# Altium project MelansonTech Isolated Current Sense Rev 2.PrjPcb
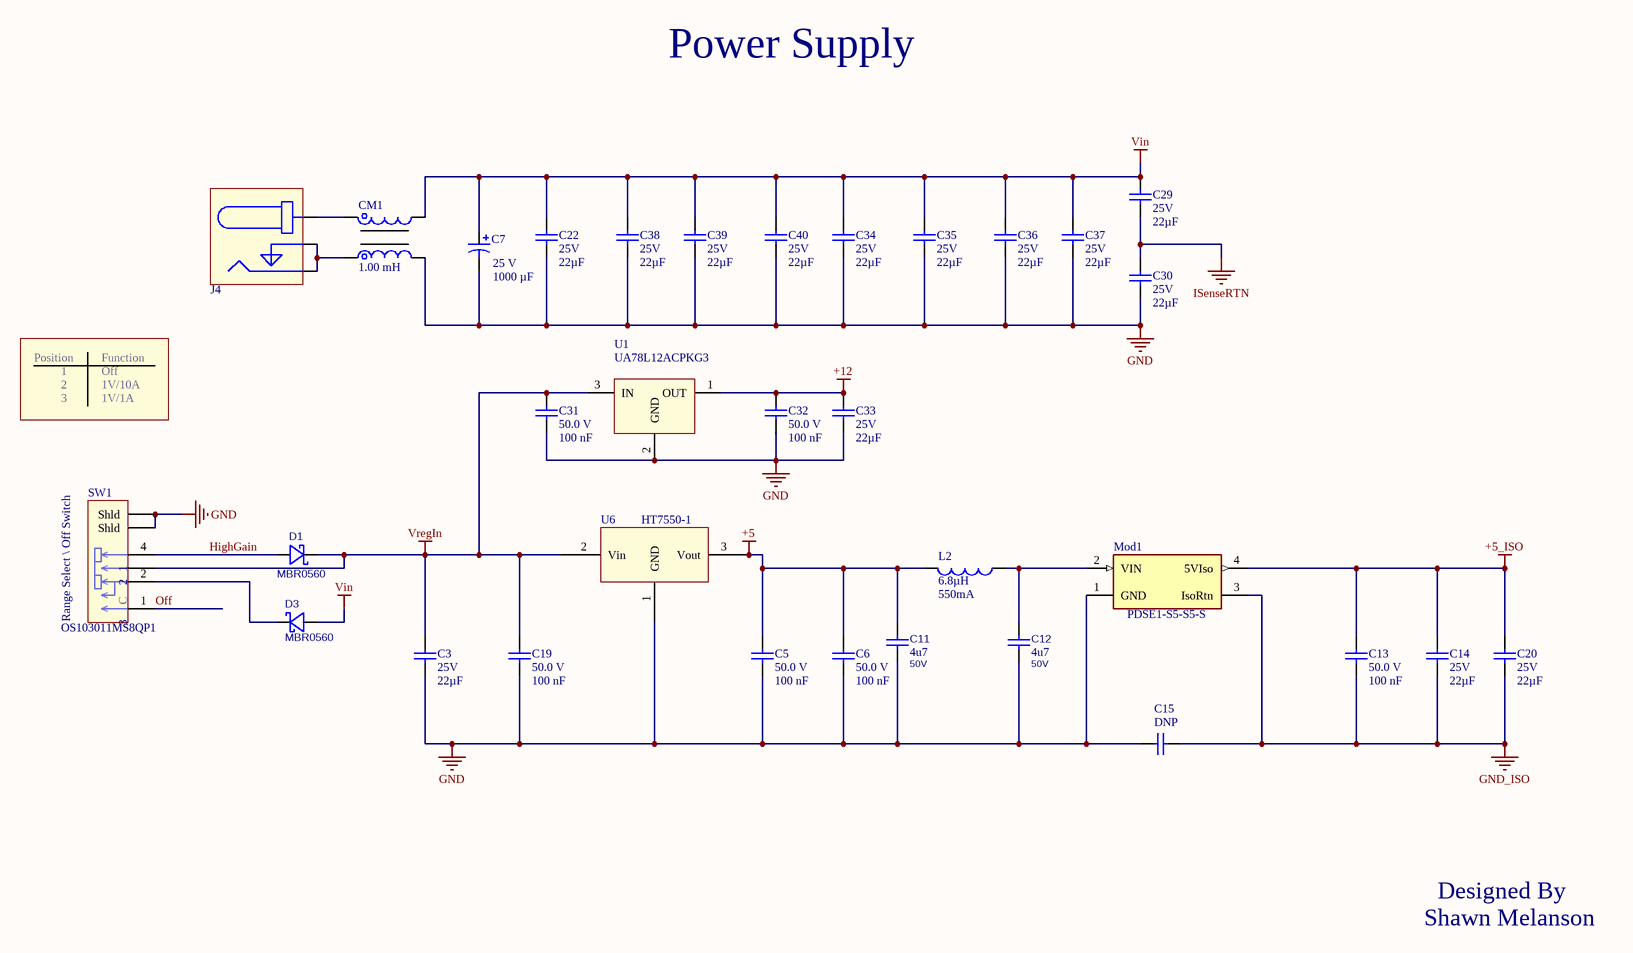
[diagram p0: MelansonTech PSU_IsolatedShuntAmp Rev2.SchDoc]
2 sheets, 102 parts. Net scope: global (net labels, ports and power ports of the same name join across sheets).
Sheets:
  MelansonTech PSU_IsolatedShuntAmp Rev2.SchDoc
  MelansonTech Isolated Shunt Amplifier rev 2.SchDoc

## Sheet MelansonTech PSU_IsolatedShuntAmp Rev2.SchDoc
size B

### Parts
C3  Voltage - Rated: 25V  Capacitance: 22µF  [Cap,0805]  (hidden comment: CL21A226MAQNNNE)
C5  Voltage Rating (DC): 50.0 V  Capacitance: 100 nF  [CAP, 0805, HD]  (hidden comment: CC0805KRX7R9BB104)
C6  Voltage Rating (DC): 50.0 V  Capacitance: 100 nF  [CAP, 0805, HD]  (hidden comment: CC0805KRX7R9BB104)
C7  Capacitance: 1000 µF  Voltage - Rated: 25 V  [Cap,5mm Lead Spaceing,14mm HIGH,10MM Dia, Polymer - RA1]  (hidden comment: A750MV108M1EAAE014)
C11  Capacitance: 4u7  Voltage: 50V  [Cap, 1206]  (hidden comment: CL31B475KBHNNNE)
C12  Capacitance: 4u7  Voltage: 50V  [Cap, 1206]  (hidden comment: CL31B475KBHNNNE)
C13  Voltage Rating (DC): 50.0 V  Capacitance: 100 nF  [Cap,0805]  (hidden comment: CC0805KRX7R9BB104)
C14  Voltage - Rated: 25V  Capacitance: 22µF  [Cap,0805]  (hidden comment: CL21A226MAQNNNE)
C15  S102K33Y5PP63K5R  [Cap, 5mm Lead Spaceing, 4mm dai]  (value not drawn)
C19  Voltage Rating (DC): 50.0 V  Capacitance: 100 nF  [CAP, 0805, HD]  (hidden comment: CC0805KRX7R9BB104)
C20  Voltage - Rated: 25V  Capacitance: 22µF  [Cap,0805]  (hidden comment: CL21A226MAQNNNE)
C22  Voltage - Rated: 25V  Capacitance: 22µF  [Cap,0805]  (hidden comment: CL21A226MAQNNNE)
C29  Voltage - Rated: 25V  Capacitance: 22µF  [Cap,0805]  (hidden comment: CL21A226MAQNNNE)
C30  Voltage - Rated: 25V  Capacitance: 22µF  [Cap,0805]  (hidden comment: CL21A226MAQNNNE)
C31  Voltage Rating (DC): 50.0 V  Capacitance: 100 nF  [CAP, 0805, HD]  (hidden comment: CC0805KRX7R9BB104)
C32  Voltage Rating (DC): 50.0 V  Capacitance: 100 nF  [CAP, 0805, HD]  (hidden comment: CC0805KRX7R9BB104)
C33  Voltage - Rated: 25V  Capacitance: 22µF  [Cap,0805]  (hidden comment: CL21A226MAQNNNE)
C34  Voltage - Rated: 25V  Capacitance: 22µF  [Cap,0805]  (hidden comment: CL21A226MAQNNNE)
C35  Voltage - Rated: 25V  Capacitance: 22µF  [Cap,0805]  (hidden comment: CL21A226MAQNNNE)
C36  Voltage - Rated: 25V  Capacitance: 22µF  [Cap,0805]  (hidden comment: CL21A226MAQNNNE)
C37  Voltage - Rated: 25V  Capacitance: 22µF  [Cap,0805]  (hidden comment: CL21A226MAQNNNE)
C38  Voltage - Rated: 25V  Capacitance: 22µF  [Cap,0805]  (hidden comment: CL21A226MAQNNNE)
C39  Voltage - Rated: 25V  Capacitance: 22µF  [Cap,0805]  (hidden comment: CL21A226MAQNNNE)
C40  Voltage - Rated: 25V  Capacitance: 22µF  [Cap,0805]  (hidden comment: CL21A226MAQNNNE)
CM1  Inductance: 1.00 mH  [CM Choke,SMD, DR331]  (hidden comment: DR331-105BE)
D1  MBR0560  [SOD123]
D3  MBR0560  [SOD123]
J4  PJ-002A  [Connector,Barrel,2.1mm,5.5mm,DC power Jack]  (value not drawn)
L2  Inductance: 6.8µH  Current Rating (Amps): 550mA  [Ind, 0805]  (hidden comment: MLZ2012N6R8LT000)
Mod1  PDSE1-S5-S5-S  [CONV_PDSE1-S5-S5-S]
SW1  OS103011MS8QP1  [Switch,Slide,.SP3T, OS103011 -Side]
U1  UA78L12ACPKG3  [SOT89-3]
U6  HT7550-1  [SOT89-3]

### Nets
+5: C5.2 C6.2 C11.2 L2.2 U6.3(Vout)
+5_ISO: C13.2 C14.2 C20.2 Mod1.4(5VIso)
+12: C32.2 C33.2 U1.1(OUT)
GND: C3.1 C5.1 C6.1 C7.2 C11.1 C12.1 C15.2 C19.1 C22.1 C30.1 C31.1 C32.1 C33.1 C34.1 C35.1 C36.1 C37.1 C38.1 C39.1 C40.1 CM1.4 Mod1.1(GND) SW1.5(Shld) SW1.6(Shld) U1.2(GND) U6.1(GND)
GND_ISO: C13.1 C14.1 C15.1 C20.1 Mod1.3(IsoRtn)
ISenseRTN: C29.1 C30.2
Vin: C7.1 C22.2 C29.2 C34.2 C35.2 C36.2 C37.2 C38.2 C39.2 C40.2 CM1.2 D3.2(A)
VregIn: C3.2 C19.2 C31.2 D1.1(C) SW1.3 U1.3(IN) U6.2(Vin)
HighGain: D1.2(A) SW1.4
Off: SW1.1
NetC12_2: C12.2 L2.1 Mod1.2(VIN)
NetCM1_1: CM1.1 J4.1
NetCM1_3: CM1.3 J4.2 J4.3
NetD3_1: D3.1(C) SW1.2

### Notes on the sheet
- Power Supply
- Position
- 1
- 2
- Function
- Off
- 1V/10A
- 3
- 1V/1A
- Range Select \ Off Switch
- (near C15) DNP
- Shawn Melanson
- Designed By
- (in symbol Switch,TH,Slide,SP3T,100MA,12V,OS103011MS8QP1) C

### Library data of the parts
C3 C14 C20 C22 C29 C30 C33-C40 = Cap,0805,22uF,25V,X5R,±20%,CL21A226MAQNNNE: CAP CER 22UF 25V X5R 0805; Manufacturer: Samsung Electro-Mechanics; Detailed Description: 22 µF ±20% 6.3V Ceramic Capacitor X5R 0805 (2012 Metric); Tolerance: ±20%; mfg P/N: CL21A226MAQNNNE; Category: Capacitors  Ceramic Capacitors; Series: CL; Part Status: Active; Temperature Coefficient: X5R; Operating Temperature: -55°C ~ 85°C; Applications: General Purpose; Mounting Type: Surface Mount, MLCC; Package / Case: 0805 (2012 Metric); Size / Dimension: 0.079" L x 0.049" W (2.00mm x 1.25mm); Thickness (Max): 0.055" (1.40mm); Supplier 1: Mouser; Supplier Part Number 1: 187-CL31B226KPHNNNE; Supplier 2: Digikey; Supplier Part Number 2: 1276-2769-6-ND; Supplier 3: Digikey; Supplier Part Number 3: 1276-2769-1-ND
C5 C6 C13 C19 C31 C32 = Cap,0805,100nf,50V,5%,CC0805KRX7R9BB104: CAP CER 0.1UF 50V X7R 0805; Manufacturer: YAGEO; Capacitance Tolerance: ±10%; Detailed Description: 0.1 µF ±10% 50V Ceramic Capacitor X7R 0805 (2012 Metric); Supplier 1: Digikey; Supplier Part Number 1: 311-1140-6-ND; Supplier 2: Digikey; Supplier Part Number 2: 311-1140-1-ND; Supplier 3: Mouser; Supplier Part Number 3: 603-CC805KRX7R9BB104; Supplier 4: Arrow Electronics; Supplier Part Number 4: CC0805KRX7R9BB104; Supplier 5: Digikey; Supplier Part Number 5: 311-1140-2-ND; Supplier 6: Future Electronics; Supplier Part Number 6: 2986263; Manufacturer Product Number: CC0805KRX7R9BB104; Category: Capacitors  Ceramic Capacitors; Series: CC; Part Status: Active; Temperature Coefficient: X7R; Operating Temperature: -55°C ~ 125°C; Applications: General Purpose; Mounting Type: Surface Mount, MLCC; Package / Case: 0805 (2012 Metric); Size / Dimension: 0.079" L x 0.049" W (2.00mm x 1.25mm); Thickness (Max): 0.033" (0.85mm)
C7 = Cap,Polar,TH,1000uF,25V,Polymer,±20%,A750MV108M1EAAE014: 1000 µF 25 V Aluminum - Polymer Capacitors Radial, Can 14mOhm 2000 Hrs @ 105°C; Manufacturer: KEMET; Tolerance: ±20%; Ripple Current @ Low Frequency: 255 mA @ 120 Hz; Ripple Current @ High Frequency: 5.1 A @ 100 kHz; Base Product Number: A750MV; mfg P/N: A750MV108M1EAAE014; Detailed Description: 1000 µF 25 V Aluminum - Polymer Capacitors Radial, Can 14mOhm 2000 Hrs @ 105°C; Category: Capacitors  Aluminum - Polymer Capacitors; Series: A750; Part Status: Active; Type: Polymer; ESR (Equivalent Series Resistance): 14mOhm; Lifetime @ Temp.: 2000 Hrs @ 105°C; Operating Temperature: -55°C ~ 105°C; Applications: General Purpose; Lead Spacing: 0.197" (5.00mm); Size / Dimension: 0.394" Dia (10.00mm); Height - Seated (Max): 0.630" (16.00mm); Mounting Type: Through Hole; Package / Case: Radial, Can; Supplier 1: Digi-Key; Supplier Part Number 1: 399-A750MV108M1EAAE014-ND; Supplier 2: Mouser; Supplier Part Number 2: 80-A750MV108M1EAAE14
C11 C12 = Cap,1206,4.7uF,10%,50V,CL31B475KBHNNNE: Cap,SMD,MLCC,4u7,50V,X7R,10%,1206; Manufacturer: Samsung; Manufacturer P/N: CL31B475KBHNNNE; Tolerance: 10%; Package: 1206; Supplier 1: LCSC; Supplier Part Number 1: C51205; Supplier 2: Digi-Key; Supplier Part Number 2: 1276-2789-1-ND
C15 = Cap,TH,Ceramic,5mm Spacing,1nF,2kV, S102K33Y5PP63K5R: CAP CER 1000PF 2KV Y5P RADIAL; Manufacturer: Vishay BC Components; Detailed Description: 1000pF ±10% 2000V (2kV) Ceramic Capacitor Y5P (B) Radial, Disc; Tolerance: ±10%; Temperature Coefficient: Y5P (B); Voltage - Rated: 2000V (2kV); Capacitance: 1nF; mfg P/N: S102K33Y5PP63K5R; Category: Capacitors  Ceramic Capacitors; Series: S; Part Status: Active; Operating Temperature: -30°C ~ 125°C; Applications: General Purpose; Mounting Type: Through Hole; Package / Case: Radial, Disc; Size / Dimension: 0.335"" Dia (8.50mm); Height - Seated (Max): 0.492"" (12.50mm); Lead Spacing: 0.197"" (5.00mm); Lead Style: Formed Leads - Kinked
CM1 = common mode, 1mH@100kHz, 500mA, SMD,2ln, DR331-105BE: CMC 1MH 500MA 2LN SMD; Lead-Free Status: Lead Free; Detailed Description: 1 mH @ 100 kHz 2 Line Common Mode Choke Surface Mount 500mA DCR 400mOhm; Category  Filters: Common Mode Chokes; Filter Type: Signal Line; Number of Lines: 2; DC Resistance (DCR) (Max): 400mOhm; Voltage Rating - DC: 80V; Voltage Rating - AC: 42V; Base Product Number: DR331; mfg P/N: DR331-105BE; Mounting Style: SMD; Current Rating: 500mA; Series: DR331; Part Status: Active; Inductance @ Frequency: 1 mH @ 100 kHz; Operating Temperature: -40°C ~ 135°C; Mounting Type: Surface Mount; Size / Dimension: 0.287" L x 0.213" W (7.30mm x 5.40mm); Height (Max): 0.197" (5.00mm); Package / Case: Horizontal, 4 Flat Lead
D1 D3 = Diode,SOD123,Shottky,60V,0.5A,MBR0560: Dio,Sig,Schtky,0.5A,60V,SOD123; Manufacturer: MCC; mfg P/N: MBR0560-TP; Details: 700mV @ 500mA, 200µA @ 60V,30pF @ 4V, 1MHz; Not Stuffed: N/S; Fast Supplier: Digi-Key; Current: 0.5A; Package: SOD123; Voltage: 60V; Supplier 1: Digi-Key; Supplier Part Number 1: MBR0560TPMSCT-ND; Supplier 2: LCSC; Supplier Part Number 2: C150515
J4 = Connector,Barrel,ID 2.1mm,OD 5.5mm,Power Connect, PJ-002A: Power Barrel Connector Jack 2.10mm ID (0.083"), 5.50mm OD (0.217") Through Hole, Right Angle; Manufacturer: CUI Inc.; Actual Diameter: 0.079" (2.00mm ID), 0.256" (6.50mm OD); Number of Positions/Contacts: 2 Conductors, 3 Contacts; Mating Length/Depth: 0.354" (9.00mm); Dielectric Material: Polybutylene Terephthalate (PBT); Internal Switch(s): Does Not Contain Switch; Shielding: Unshielded; Voltage - Rated: 24VDC; Current Rating (Amps): 2.5A; Material Flammability Rating: UL94 V-0; Body Color: Black; mfg P\N: PJ-002A; Industry Recognized Mating Diameter: 2.10mm ID (0.083"), 5.50mm OD (0.217"); Connector Type: Jack; Mounting Type: Through Hole, Right Angle; Termination: Solder Eyelet(s); Contact Material - Plating: Tin; Operating Temperature: -25°C ~ 85°C; Contact Material: Brass, Copper Alloy; Supplier 1: Digi-Key; Supplier Part Number 1: CP-002A-ND
L2 = Ind,0805,6.8uH,550mA,0.25Ω, MLZ2012N6R8LT000: FIXED IND 6.8UH 550MA 250 MOHM; Manufacturer: TDK Corporation; Detailed Description: 6.8µH Shielded Multilayer Inductor 550mA 250mOhm 0805 (2012 Metric); Type: Multilayer; Material - Core: Ferrite; Tolerance: ±20%; Current - Saturation: 110mA; Shielding: Shielded; Frequency - Self Resonant: 60MHz; Inductance Frequency - Test: 2MHz; mfg P/N: MLZ2012N6R8LT000; Category: Inductors, Coils, Chokes  Fixed Inductors; Series: MLZ; Part Status: Active; DC Resistance (DCR): 250mOhm; Operating Temperature: -55°C ~ 125°C; Mounting Type: Surface Mount; Package / Case: 0805 (2012 Metric); Supplier Device Package: 0805 (2012 Metric); Size / Dimension: 0.079"" L x 0.049"" W (2.00mm x 1.25mm); Height - Seated (Max): 0.041"" (1.05mm); Supplier 1: Digi-Key; Supplier Part Number 1: 445-6761-1-ND; Supplier 2: LCSC; Supplier Part Number 2: C82157
Mod1 = Mod,PSU,4.5-5.5Vin,5Vout,1W, PDSE1-S5-S5-S: DC-DC ISOLATED, 1 W, 4.5-5.5 VDC; Manufacturer: CUI Inc.; Detailed Description: Isolated Module DC DC Converter 1 Output 5V    200mA 4.5V - 5.5V Input; Voltage - Isolation: 3kV; Voltage - Input (Min): 4.5V; Voltage - Input (Max): 5.5V; Voltage - Output 1: 5V; Current - Output (Max): 200mA; Efficiency: 82%; Approval Agency: CE, cURus; Number of Outputs: 1; Power (Watts): 1W; mfg P/N: PDSE1-S5-S5-S; Series: PDSE1-S (1W); Category: Power Supplies - Board Mount  DC DC Converters; Part Status: Active; Type: Isolated Module; Applications: ITE (Commercial); Features: SCP; Operating Temperature: -40°C ~ 105°C (With Derating); Mounting Type: Through Hole; Package / Case: 4-SIP Module; Size / Dimension: 0.46"" L x 0.24"" W x 0.40"" H (11.6mm x 6.0mm x 10.2mm); Supplier 1: Digi-Key; Supplier Part Number 1: 102-6291-ND
SW1 = Switch,TH,Slide,SP3T,100MA,12V,OS103011MS8QP1: SWITCH SLIDE SP3T 100MA 12V; Manufacturer: C&K; Detailed Description: Slide Switch SP3T Through Hole; Switch Function: On-On-On; Current Rating (Amps): 100mA (DC); Actuator Type: Standard; Actuator Length: 4.00mm; Actuator Material: Polyoxymethylene (Acetal) (POM); Switch Travel: 2.00mm; Mechanical Life: 10,000 Cycles; mfg P/N: OS103011MS8QP1; Part Status: Active; Circuit: SP3T; Voltage Rating - DC: 12V; Contact Material: Copper Alloy; Contact Finish: Silver; Mounting Type: Through Hole; Termination Style: PC Pin; Features: Epoxy Sealed Terminals; Operating Temperature: -30°C ~ 70°C; Electrical Life: 10,000 Cycles; Supplier 1: Digi-Key; Supplier Part Number 1: CKN9543-ND; Supplier 2: LCSC; Supplier Part Number 2: C221831
U1 = Reg,Linear,Pos,Fixed,12Vout,27Vin,100mA,UA78L12ACPKG3: IC REG LINEAR 12V 100MA SOT89-3; Manufacturer: Texas Instruments; Detailed Description: Linear Voltage Regulator IC Positive Fixed 1 Output 100mA SOT-89-3; Output Configuration: Positive; Output Type: Fixed; Voltage - Input (Max): 27V; Voltage Dropout (Max): 1.7V @ 40mA; PSRR: 42dB (120Hz); Protection Features: Over Current, Over Temperature, Reverse Polarity, Short Circuit; Number of Regulators: 1; mfg P/N: UA78L12ACPKG3; Category: Integrated Circuits (ICs)  PMIC - Voltage Regulators - Linear; Part Status: Active; Voltage - Output (Min/Fixed): 12V; Current - Output: 100mA; Operating Temperature: 0°C ~ 125°C; Mounting Type: Surface Mount; Package / Case: TO-243AA; Supplier Device Package: SOT-89-3; Base Product Number: UA78L12; Supplier 1: Digi-Key; Supplier Part Number 1: 296-50454-6-ND; Supplier 2: Mouser; Supplier Part Number 2: 595-UA78L12ACPKG3; Supplier 3: Arrow Electronics; Supplier Part Number 3: UA78L12ACPKG3
U6 = Reg,Linear,Fixed,SOT-89-3,30Vin,5Vout,150mA,HT7550-1: LOW DROPOUT REGULATORS(LDO) POSITIVE FIXED 55MV @ 1MA 30V 5V 150MA SOT-89(SOT-89-3) ROHS; Manufacturer: Holtek Semicon; Input Voltage (Max): 30Vdc; Output voltage accuracy: tolerance ±3%; Quiescent current: 2.5μA; Output Voltage: 5Vdc; LCSC Part #: C16106; Package: SOT-89-3; Output Current (Max): 150mA; mfg P/N: HT7550-1

## Sheet MelansonTech Isolated Shunt Amplifier rev 2.SchDoc
size C
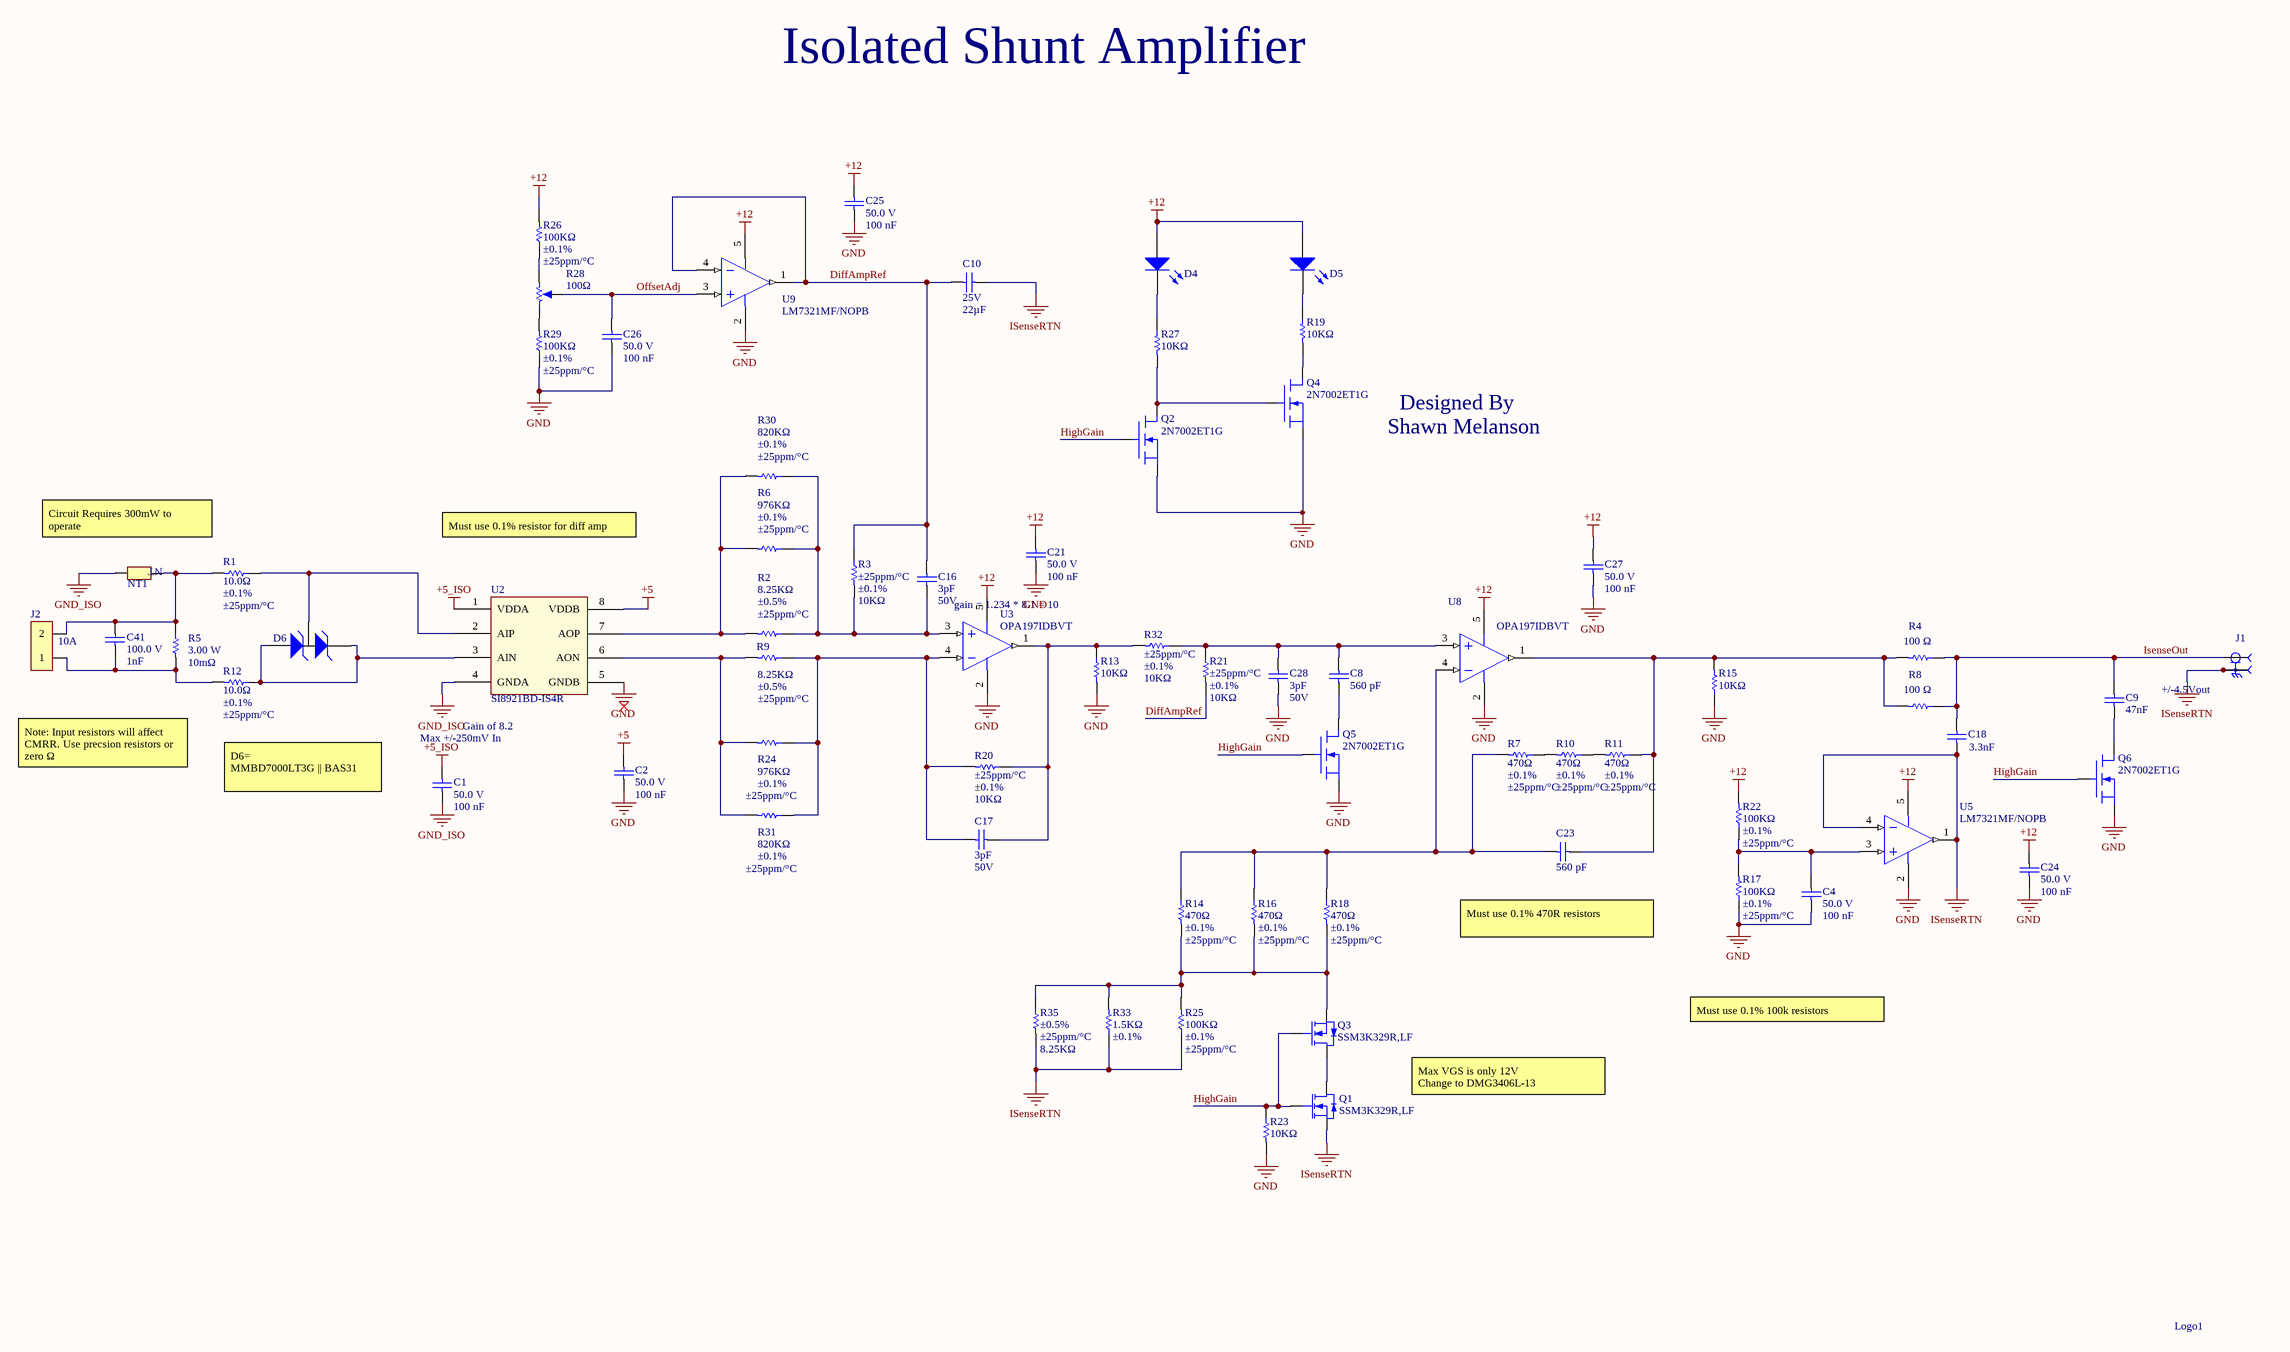
[diagram p1: MelansonTech Isolated Shunt Amplifier rev 2.SchDoc]

### Parts
C1  Voltage Rating (DC): 50.0 V  Capacitance: 100 nF  [CAP, 0805, HD]  (hidden comment: CC0805KRX7R9BB104)
C2  Voltage Rating (DC): 50.0 V  Capacitance: 100 nF  [CAP, 0805, HD]  (hidden comment: CC0805KRX7R9BB104)
C4  Voltage Rating (DC): 50.0 V  Capacitance: 100 nF  [CAP, 0805, HD]  (hidden comment: CC0805KRX7R9BB104)
C8  Capacitance: 560 pF  [CAP, 0805, HD]  (hidden comment: CC0805JRNPO9BN561)
C9  Capacitance: 47nF  [CAP, 0805, HD]  (hidden comment: CL21B473KCFNNNE)
C10  Voltage - Rated: 25V  Capacitance: 22µF  [Cap,0805]  (hidden comment: CL21A226MAQNNNE)
C16  Capacitance: 3pF  Voltage - Rated: 50V  [CAP, 0805, HD]  (hidden comment: CC0805CRNPO9BN3R0)
C17  Capacitance: 3pF  Voltage - Rated: 50V  [CAP, 0805, HD]  (hidden comment: CC0805CRNPO9BN3R0)
C18  Capacitance: 3.3nF  [CAP, 0805, HD]  (hidden comment: CC0805KPX7R9BB332)
C21  Voltage Rating (DC): 50.0 V  Capacitance: 100 nF  [CAP, 0805, HD]  (hidden comment: CC0805KRX7R9BB104)
C23  Capacitance: 560 pF  [Cap,0805]  (hidden comment: CC0805JRNPO9BN561)
C24  Voltage Rating (DC): 50.0 V  Capacitance: 100 nF  [CAP, 0805, HD]  (hidden comment: CC0805KRX7R9BB104)
C25  Voltage Rating (DC): 50.0 V  Capacitance: 100 nF  [CAP, 0805, HD]  (hidden comment: CC0805KRX7R9BB104)
C26  Voltage Rating (DC): 50.0 V  Capacitance: 100 nF  [CAP, 0805, HD]  (hidden comment: CC0805KRX7R9BB104)
C27  Voltage Rating (DC): 50.0 V  Capacitance: 100 nF  [CAP, 0805, HD]  (hidden comment: CC0805KRX7R9BB104)
C28  Capacitance: 3pF  Voltage - Rated: 50V  [CAP, 0805, HD]  (hidden comment: CC0805CRNPO9BN3R0)
C41  Voltage Rating (DC): 100.0 V  Capacitance: 1nF  [CAP, 0805, HD]  (hidden comment: C0805X102J1GACAUTO)
D4  OVLBB4C7  [LED,TH,T1,3MM-Vert]  (value not drawn)
D5  OVLBB4C7  [LED,TH,T1,3MM-Vert]  (value not drawn)
D6  BAT54SLT1G  [SOT23-3]  (value not drawn)
J1  142-0701-801  [CINCH_142-0701-801]  (value not drawn)
J2  TE Connectivity 282836-2  [TERM BLOCK 2POS SIDE ENTRY 5MM]  (value not drawn)
Logo1  Open Source Logo  [Symbol,Open Source - No Text]  (value not drawn)
NT1  Net Tie,0.254mm  [0.254mm Net Tie]  (value not drawn)  (net tie, no BOM)
Q1  SSM3K329R,LF  [SOT23-3]
Q2  2N7002ET1G  [SOT23-3]
Q3  SSM3K329R,LF  [SOT23-3]
Q4  2N7002ET1G  [SOT23-3]
Q5  2N7002ET1G  [SOT23-3]
Q6  2N7002ET1G  [SOT23-3]
R1  Resistance: 10.0Ω  Tolerance: ±0.1%  Temperature Coefficient: ±25ppm/°C  [res, 0805, HD]  (hidden comment: RNCS0805BKE10R0)
R2  Tolerance: ±0.5%  Temperature Coefficient: ±25ppm/°C  Resistance: 8.25KΩ  [res, 0805, HD]  (hidden comment: RR1220P-8251-D-M)
R3  Temperature Coefficient: ±25ppm/°C  Resistance Tolerance: ±0.1%  Resistance: 10KΩ  [res, 0805, HD]  (hidden comment: RG2012P-103-B-T5)
R4  Resistance: 100 Ω  [res, 0805, HD]  (hidden comment: CRCW0805100RJNEAC)
R5  Power Rating: 3.00 W  Resistance: 10mΩ  [Res 2512]  (hidden comment: CRA2512-FZ-R010ELF)
R6  Resistance: 976KΩ  Tolerance: ±0.1%  Temperature Coefficient: ±25ppm/°C  [res, 0805, HD]  (hidden comment: ERA-6AEB9763V)
R7  Resistance: 470Ω  Tolerance: ±0.1%  Temperature Coefficient: ±25ppm/°C  [res, 0805, HD]  (hidden comment: ERA-6AEB471V)
R8  Resistance: 100 Ω  [res, 0805, HD]  (hidden comment: CRCW0805100RJNEAC)
R9  Tolerance: ±0.5%  Temperature Coefficient: ±25ppm/°C  Resistance: 8.25KΩ  [res, 0805, HD]  (hidden comment: RR1220P-8251-D-M)
R10  Resistance: 470Ω  Tolerance: ±0.1%  Temperature Coefficient: ±25ppm/°C  [res, 0805, HD]  (hidden comment: ERA-6AEB471V)
R11  Resistance: 470Ω  Tolerance: ±0.1%  Temperature Coefficient: ±25ppm/°C  [res, 0805, HD]  (hidden comment: ERA-6AEB471V)
R12  Resistance: 10.0Ω  Tolerance: ±0.1%  Temperature Coefficient: ±25ppm/°C  [res, 0805, HD]  (hidden comment: RNCS0805BKE10R0)
R13  Resistance: 10KΩ  [res, 0805, HD]  (hidden comment: Vishay / Dale CRCW080510K0FKTA)
R14  Resistance: 470Ω  Tolerance: ±0.1%  Temperature Coefficient: ±25ppm/°C  [res, 0805, HD]  (hidden comment: ERA-6AEB471V)
R15  Resistance: 10KΩ  [res, 0805, HD]  (hidden comment: Vishay / Dale CRCW080510K0FKTA)
R16  Resistance: 470Ω  Tolerance: ±0.1%  Temperature Coefficient: ±25ppm/°C  [res, 0805, HD]  (hidden comment: ERA-6AEB471V)
R17  Resistance: 100KΩ  Tolerance: ±0.1%  Temperature Coefficient: ±25ppm/°C  [res, 0805, HD]  (hidden comment: ERA-6AEB104V)
R18  Resistance: 470Ω  Tolerance: ±0.1%  Temperature Coefficient: ±25ppm/°C  [res, 0805, HD]  (hidden comment: ERA-6AEB471V)
R19  Resistance: 10KΩ  [res, 0805, HD]  (hidden comment: Vishay / Dale CRCW080510K0FKTA)
R20  Temperature Coefficient: ±25ppm/°C  Resistance Tolerance: ±0.1%  Resistance: 10KΩ  [res, 0805, HD]  (hidden comment: RG2012P-103-B-T5)
R21  Temperature Coefficient: ±25ppm/°C  Resistance Tolerance: ±0.1%  Resistance: 10KΩ  [res, 0805, HD]  (hidden comment: RG2012P-103-B-T5)
R22  Resistance: 100KΩ  Tolerance: ±0.1%  Temperature Coefficient: ±25ppm/°C  [res, 0805, HD]  (hidden comment: ERA-6AEB104V)
R23  Resistance: 10KΩ  [res, 0805, HD]  (hidden comment: Vishay / Dale CRCW080510K0FKTA)
R24  Resistance: 976KΩ  Tolerance: ±0.1%  Temperature Coefficient: ±25ppm/°C  [res, 0805, HD]  (hidden comment: ERA-6AEB9763V)
R25  Resistance: 100KΩ  Tolerance: ±0.1%  Temperature Coefficient: ±25ppm/°C  [res, 0805, HD]  (hidden comment: ERA-6AEB104V)
R26  Resistance: 100KΩ  Tolerance: ±0.1%  Temperature Coefficient: ±25ppm/°C  [res, 0805, HD]  (hidden comment: ERA-6AEB104V)
R27  Resistance: 10KΩ  [res, 0805, HD]  (hidden comment: Vishay / Dale CRCW080510K0FKTA)
R28  Resistance: 100Ω  [Res,SMD,POT,TC33 Series]  (hidden comment: TC33X-2-101E)
R29  Resistance: 100KΩ  Tolerance: ±0.1%  Temperature Coefficient: ±25ppm/°C  [res, 0805, HD]  (hidden comment: ERA-6AEB104V)
R30  Resistance: 820KΩ  Tolerance: ±0.1%  Temperature Coefficient: ±25ppm/°C  [res, 0805, HD]  (hidden comment: RG2012P-824-D-T5)
R31  Resistance: 820KΩ  Tolerance: ±0.1%  Temperature Coefficient: ±25ppm/°C  [res, 0805, HD]  (hidden comment: RG2012P-824-D-T5)
R32  Temperature Coefficient: ±25ppm/°C  Resistance Tolerance: ±0.1%  Resistance: 10KΩ  [res, 0805, HD]  (hidden comment: RG2012P-103-B-T5)
R33  Resistance: 1.5KΩ  Tolerance: ±0.1%  [res, 0805, HD]  (hidden comment: RG2012P-152-B-T5)
R35  Tolerance: ±0.5%  Temperature Coefficient: ±25ppm/°C  Resistance: 8.25KΩ  [res, 0805, HD]  (hidden comment: RR1220P-8251-D-M)
U2  SI8921BD-IS4R  [SOIC-8 DWV]
U3  OPA197IDBVT  [SOT23-5]
U5  LM7321MF/NOPB  [SOT23-5]
U8  OPA197IDBVT  [SOT23-5]
U9  LM7321MF/NOPB  [SOT23-5]

### Nets
+5: C2.2 U2.8(VDDB)
+5_ISO: C1.2 U2.1(VDDA)
+12: C21.2 C24.2 C25.2 C27.2 D4.1(A) D5.1(A) R22.2 R26.2 U3.5(V+) U5.5(V+) U8.5(V+) U9.5(V+)
GND: C2.1 C4.1 C21.1 C24.1 C25.1 C26.1 C27.1 C28.1 Q2.2(S) Q4.2(S) Q5.2(S) Q6.2(S) R13.2 R15.1 R17.1 R23.2 R29.1 U2.5(GNDB) U3.2(V-) U5.2(V-) U8.2(V-) U9.2(V-)
GND_ISO: C1.1 NT1.2 U2.4(GNDA)
ISenseRTN: C10.1 C18.1 J1.S1 J1.S2 J1.S3 J1.S4 Q1.2(S) R25.1 R33.1 R35.2 U5.1(OUT) U5.4(IN-)
DiffAmpRef: C10.2 C16.1 R3.1 R21.2 U9.1(OUT) U9.4(IN-)
HighGain: Q1.1(G) Q2.1(G) Q3.1(G) Q5.1(G) Q6.1(G) R23.1
IsenseOut: C9.2 C18.2 J1.1 R4.1 R8.1
OffsetAdj: C26.2 R28.2 U9.3(IN+)
NetC4_2: C4.2 R17.2 R22.1 U5.3(IN+)
NetC8_1: C8.1 Q5.3(D)
NetC8_2: C8.2 C28.2 R21.1 R32.1 U8.3(1IN+)
NetC9_1: C9.1 Q6.3(D)
NetC16_2: C16.2 R2.1 R3.2 R6.1 R30.1 U3.3(1IN+)
NetC17_1: C17.1 R13.1 R20.1 R32.2 U3.1(1OUT)
NetC17_2: C17.2 R9.1 R20.2 R24.1 R31.1 U3.4(1IN-)
NetC23_1: C23.1 R4.2 R8.2 R11.1 R15.2 U8.1(1OUT)
NetC23_2: C23.2 R7.2 R14.1 R16.1 R18.1 U8.4(1IN-)
NetC41_1: C41.1 J2.1 R5.2 R12.2
NetC41_2: C41.2 J2.2 NT1.1 R1.2 R5.1
NetD4_2: D4.2(K) R27.1
NetD5_2: D5.2(K) R19.1
NetD6_1: D6.1(A) D6.2(K) R12.1 U2.3(AIN)
NetD6_3: D6.3(AK) R1.1 U2.2(AIP)
NetQ1_3: Q1.3(D) Q3.3(D)
NetQ2_3: Q2.3(D) Q4.1(G) R27.2
NetQ3_2: Q3.2(S) R14.2 R16.2 R18.2 R25.2 R33.2 R35.1
NetQ4_3: Q4.3(D) R19.2
NetR2_2: R2.2 R6.2 R30.2 U2.7(AOP)
NetR7_1: R7.1 R10.2
NetR9_2: R9.2 R24.2 R31.2 U2.6(AON)
NetR10_1: R10.1 R11.2
NetR26_1: R26.1 R28.3
NetR28_1: R28.1 R29.2

### Notes on the sheet
- Isolated Shunt Amplifier
- Shawn Melanson
- Designed By
- Circuit Requires 300mW to operate
- Must use 0.1% resistor for diff amp
- gain = 1.234 * 8.1 = 10
- 10A
- (near J1) +/-4.5Vout
- Max +/-250mV In
- (near U2) Gain of 8.2
- Note: Input resistors will affect CMRR. Use precsion resistors or zero Ω
- D6=
  MMBD7000LT3G || BAS31
- Must use 0.1% 470R resistors
- Must use 0.1% 100k resistors
- Max VGS is only 12V
  Change to DMG3406L-13
- (in symbol Net Tie,0.254mm) NT

### Library data of the parts
C1 C2 C4 C21 C24-C27 = Cap,0805,100nf,50V,5%,CC0805KRX7R9BB104: as C5 on sheet MelansonTech PSU_IsolatedShuntAmp Rev2; Supplier 1: Digikey; Supplier Part Number 1: 311-1140-6-ND; Supplier 2: Digikey; Supplier Part Number 2: 311-1140-1-ND; Supplier 3: Mouser; Supplier Part Number 3: 603-CC805KRX7R9BB104; Supplier 4: Arrow Electronics; Supplier Part Number 4: CC0805KRX7R9BB104; Supplier 5: Digikey; Supplier Part Number 5: 311-1140-2-ND; Supplier 6: Future Electronics; Supplier Part Number 6: 2986263; Manufacturer Product Number: CC0805KRX7R9BB104; Category: Capacitors  Ceramic Capacitors; Series: CC; Part Status: Active; Temperature Coefficient: X7R; Operating Temperature: -55°C ~ 125°C; Applications: General Purpose; Mounting Type: Surface Mount, MLCC; Package / Case: 0805 (2012 Metric); Size / Dimension: 0.079" L x 0.049" W (2.00mm x 1.25mm); Thickness (Max): 0.033" (0.85mm)
C8 C23 = Cap,0805,560pF,50V,±5%,C0G,NP0,CC0805JRNPO9BN561: CAP CER 560PF 50V C0G/NPO 0805; Mfr: YAGEO; Detailed Description: 560 pF ±5% 50V Ceramic Capacitor C0G, NP0 0805 (2012 Metric); Tolerance: ±5%; mfg P/N: CC0805JRNPO9BN561; Category: Capacitors  Ceramic Capacitors; Series: CC; Part Status: Active; Voltage - Rated: 50V; Temperature Coefficient: C0G, NP0; Operating Temperature: -55°C ~ 125°C; Applications: General Purpose; Mounting Type: Surface Mount, MLCC; Package / Case: 0805 (2012 Metric); Size / Dimension: 0.079" L x 0.049" W (2.00mm x 1.25mm); Thickness (Max): 0.024" (0.60mm)
C9 = Cap,0805,47nF,100V,±10%,CL21B473KCFNNNE: CAP CER 0.047UF 100V X7R 0805; Manufacturer: Samsung Electro-Mechanics; Detailed Description: 0.047 µF ±10% 100V Ceramic Capacitor X7R 0805 (2012 Metric); Tolerance: ±10%; mfg P/N: CL21B473KCFNNNE; Category: Capacitors  Ceramic Capacitors; Series: CL; Part Status: Active; Voltage - Rated: 100V; Temperature Coefficient: X7R; Operating Temperature: -55°C ~ 125°C; Applications: General Purpose; Mounting Type: Surface Mount, MLCC; Package / Case: 0805 (2012 Metric); Size / Dimension: 0.079" L x 0.049" W (2.00mm x 1.25mm); Thickness (Max): 0.053" (1.35mm); Supplier 1: Digikey; Supplier Part Number 1: 1276-2960-1-ND
C10 = Cap,0805,22uF,25V,X5R,±20%,CL21A226MAQNNNE: as C3 on sheet MelansonTech PSU_IsolatedShuntAmp Rev2; mfg P/N: CL21A226MAQNNNE; Category: Capacitors  Ceramic Capacitors; Series: CL; Part Status: Active; Temperature Coefficient: X5R; Operating Temperature: -55°C ~ 85°C; Applications: General Purpose; Mounting Type: Surface Mount, MLCC; Package / Case: 0805 (2012 Metric); Size / Dimension: 0.079" L x 0.049" W (2.00mm x 1.25mm); Thickness (Max): 0.055" (1.40mm); Supplier 1: Mouser; Supplier Part Number 1: 187-CL31B226KPHNNNE; Supplier 2: Digikey; Supplier Part Number 2: 1276-2769-6-ND; Supplier 3: Digikey; Supplier Part Number 3: 1276-2769-1-ND
C16 C17 C28 = CAP,0805,3pF,COG,NPO,CC0805CRNPO9BN3R0: CAP CER 3PF 50V C0G/NPO 0805; Manufacturer: YAGEO; Detailed Description: 3 pF ±0.25pF 50V Ceramic Capacitor C0G, NP0 0805 (2012 Metric); Tolerance: ±0.25pF; Temperature Coefficient: C0G, NP0; mfg P/N: CC0805CRNPO9BN3R0; Category: Capacitors  Ceramic Capacitors; Series: CC; Part Status: Active; Operating Temperature: -55°C ~ 125°C; Applications: General Purpose; Mounting Type: Surface Mount, MLCC; Package / Case: 0805 (2012 Metric); Size / Dimension: 0.079" L x 0.049" W (2.00mm x 1.25mm); Thickness (Max): 0.024" (0.60mm); Supplier 1: Future Electronics; Supplier Part Number 1: 9724337; Supplier 2: Arrow Electronics; Supplier Part Number 2: CC0805CRNPO9BN3R0; Supplier 3: Digikey; Supplier Part Number 3: 311-1092-1-ND; Supplier 4: Digikey; Supplier Part Number 4: 311-1092-6-ND; Supplier 5: Digikey; Supplier Part Number 5: 311-1092-2-ND; Supplier 6: Mouser; Supplier Part Number 6: 603-CC805CRNPO9BN3R0
C18 = Cap,0805,3.3nF,50V,±10%,CC0805KPX7R9BB332: CAP CER 3300PF 50V X7R 0805; Manufacturer: YAGEO; Detailed Description: 3300 pF ±10% 50V Ceramic Capacitor X7R 0805 (2012 Metric); Tolerance: ±10%; mfg P/N: CC0805KPX7R9BB332; Category: Capacitors  Ceramic Capacitors; Mfr: YAGEO; Series: CC; Part Status: Active; Voltage - Rated: 50V; Temperature Coefficient: X7R; Operating Temperature: -55°C ~ 125°C; Applications: General Purpose; Mounting Type: Surface Mount, MLCC; Package / Case: 0805 (2012 Metric); Size / Dimension: 0.079" L x 0.049" W (2.00mm x 1.25mm); Thickness (Max): 0.028" (0.70mm)
C41 = Cap,0805,1nF,±5%,100Vdc,CL10F104ZB8NNNC: CAPACITOR, 1NF, 100V, NP0, 0805; Capacitance Tolerance: ±5%; Dielectric Characteristic: C0G/NP0; Dielectric Material: Ceramic; Lead-Free Status: Lead Free; Case/Package: 0805; Mounting Style: Surface Mount; Octopart Url: https://octopart.com/c0805x102j1gacauto-kemet-23280135; Packaging: Cut Tape (CT); REACH SVHC Compliance: No SVHC; RoHS: Compliant; mfg P/N: C0805X102J1GACAUTO; Supplier 1: Digi-Key; Supplier Part Number 1: 399-19430-1-ND
D4 D5 = LED,TH,T1,3mm,Blue,OVLBB4C7: Blue 470nm LED Indication - Discrete 3.2V Radial; Mfg: TT Electronics/Optek Technology; Product Status: Active; Configuration: Standard; Lens Color: Colorless; Lens Transparency: Clear; Millicandela Rating: 1800mcd; Lens Style: Round with Domed Top; Lens Size: 3mm, T-1; Current - Test: 20mA; Viewing Angle: 45°; Base Product Number: OVLBB4; Category: Optoelectronics  LED Indication - Discrete; Color: Blue; Voltage - Forward (Vf) (Typ): 3.2V; Mounting Type: Through Hole; Wavelength - Dominant: 470nm; Package / Case: Radial; Supplier Device Package: 3mm; Height (Max): 5.35mm
D6 = Diode,Shottky,Array,Series,30V,200mA,BAT54SLT1G: Diode Array 1 Pair Series Connection Schottky 30V 200mA (DC) Surface Mount TO-236-3, SC-59, SOT-23-3; Manufacturer: ON Semiconductor; Voltage - Forward (Vf) (Max) @ If: 800mV @ 100mA; Speed: Small Signal =< 200mA (Io), Any Speed; Reverse Recovery Time (trr): 5ns; Current - Reverse Leakage @ Vr: 2µA @ 25V; Detailed Description: Diode Array 1 Pair Series Connection Schottky 30V 200mA (DC) Surface Mount TO-236-3, SC-59, SOT-23-3; mfg P/N: BAT54SLT1G; Diode Type: Schottky; Diode Configuration: 1 Pair Series Connection; Voltage - DC Reverse (Vr) (Max): 30V; Current - Average Rectified (Io) (per Diode): 200mA (DC); Operating Temperature - Junction: 125°C (Max); Mounting Type: Surface Mount; Package / Case: TO-236-3, SC-59, SOT-23-3; Supplier Device Package: SOT-23-3 (TO-236); Base Part Number: BAT54SL; Supplier 1: Digi-Key; Supplier Part Number 1: BAT54SLT1GOSCT-ND; Supplier 2: LCSC; Supplier Part Number 2: C19726
J1 = Conn,SMA,Female,End Launch,142-0701-801: CONN SMA JACK STR 50OHM EDGE MNT; Manufacturer: Cinch Connectivity Solutions Johnson; Detailed Description: SMA Connector Jack, Female Socket 50Ohm Board Edge, End Launch Solder; Connector: Style   SMA; Connector Type: Jack, Female Socket; Contact Termination: Solder; Body Material: Brass; Body Finish: Gold; Dielectric Material: Polytetrafluoroethylene (PTFE); Center Contact Material: Beryllium Copper; Mating Cycles: 500; Number of Ports: 1; Frequency - Max: 18GHz; Voltage Rating: 335V; mfg P/N: 142-0701-801; Category: Connectors, Interconnects  Coaxial Connectors (RF); Part Status: Active; Shield Termination: Solder; Impedance: 50Ohm; Mounting Type: Board Edge, End Launch; Fastening Type: Threaded; Housing Color: Gold; Center Contact Plating: Gold; Operating Temperature: -65°C ~ 165°C; Supplier 1: Digi-Key; Supplier Part Number 1: J502-ND
J2 = TERM BLOCK 2POS SIDE ENTRY 5MM, 282836-2: Wire to Board 2 Position 5 mm Pitch 30-16 AWG Euro Style Terminal Block; Voltage Rating (AC): 250.0 V; ELV Compliant: Compliant; Current Rating: 13.5 A; Number of Contacts: 2; Pin Pitch: 0.005 m; Lead-Free Status: Lead Free; Wire Gauge: 15.0 AWG; RoHS: Compliant; Contact Material: Brass; Contact Plating: Tin; Color: Green; Manufacturer Part Number: 282836-2; Flammability Rating: UL 94 V-0; Mounting Style: PCB; Housing Material: Nylon 6/6; Insulation Material: Nylon; Housing Color: Green; Orientation: Right Angle; Lifecycle Status: Active; REACH SVHC Compliance: No SVHC; Number of Positions: 2; Supplier 1: TME; Supplier 2: Newark; Supplier 3: Digi-Key; Supplier 4: Digi-Key; Supplier Part Number 4: A98076-ND
Logo1 = Symbol,Open Source: Open Source Silk Screen Logo
Q1 Q3 = MOSFET.N-Chan, SOT-23-3,3.5A,30V,1W,SSM3K329R,LF: N-Channel 30V 3.5A (Ta) 1W (Ta) Surface Mount SOT-23F; Lead-Free Status: Lead Free; Drain to Source Voltage (Vdss): 30Vdc; Technology MOSFET: (Metal Oxide); Drive Voltage (Max Rds On, Min Rds On): 1.8V, 4V; Rds On (Max) @ Id, Vgs: 126 mOhm @ 1A, 4V; Vgs(th) (Max) @ Id: 1V @ 1mA; Gate Charge (Qg) (Max) @ Vgs: 1.5nC @ 4V; Vgs (Max): ±12V; Input Capacitance (Ciss) (Max) @ Vds: 123pF @ 15V; RoHS: Compliant; REACH SVHC Compliance: No SVHC; Mounting Style: Surface Mount; Lifecycle Status: Active; Current - Continuous Drain (Id) @ 25°C: 3.5A; Power Dissipation (Max): 1W; FET Type: N-Channel; Operating Temperature: 150°C (TJ); Mounting Type: Surface Mount; Supplier Device Package: SOT-23F; Package / Case: SOT-23-3  Flat Leads; mfg P/N: SSM3K329R,LF; Supplier 1: Digi-Key; Supplier Part Number 1: SSM3K329RLFDKR-ND
Q2 Q4-Q6 = MOSFET,N-Channel,SOT23,0.25A,60V,2N7002ET1G: Small Signal MOSFET, 60 V, 310 mA, Single, N-Channel, 3-Pin SOT-23, Pb-Free, Tape and Reel; Manufacturer: ON Semiconductor; Continuous Drain Current (Ids): 0.25A; Lead-Free Status: Lead Free; Drain to Source Voltage (Vds): 60.0 V; Power Dissipation (Max): 350mW (Ta); REACH SVHC Compliance: No SVHC; Number of Pins: 3; Halogen Free Status: Halogen Free; Case/Package: SOT-23-3; Polarity: N-Channel; RoHS: Compliant; Lifecycle Status: Active; Supplier 1: Digi-Key; Supplier Part Number 1: 2N7002ET1GOSCT-ND; Supplier 2: LCSC; Supplier Part Number 2: C71533; Manufacturer Part Number: 2N7002ET1G
R1 R12 = Res,0805,10.0Ω,0.1%,±25ppm/°C,0.1W,RNCS0805BKE10R0: RES 10 OHM 0.1% 1/10W 0805; Manufacturer: Stackpole Electronics Inc; Detailed Description: 10 Ohms ±0.1% 0.1W, 1/10W Chip Resistor 0805 (2012 Metric) Anti-Corrosive, Automotive AEC-Q200, Moisture Resistant Thin Film; Power (Watts): 0.1W, 1/10W; Category: Resistors  Chip Resistor - Surface Mount; Series: RNCS; Part Status: Active; Composition: Thin Film; Features: Anti-Corrosive, Automotive AEC-Q200, Moisture Resistant; Operating Temperature: -55°C ~ 155°C; Package / Case: 0805 (2012 Metric); Supplier Device Package: 0805; Ratings: AEC-Q200; Size / Dimension: 0.079" L x 0.049" W (2.00mm x 1.25mm); Height - Seated (Max): 0.026" (0.65mm); Number of Terminations: 2
R2 R9 R35 = Res,0805,8.25KΩ,0.5%,±25ppm/°C,RR1220P-8251-D-M: RES SMD 8.25KOHM 0.5% 1/10W 0805; Manufacturer: Susumu; Detailed Description: 8.25 kOhms ±0.5% 0.1W, 1/10W Chip Resistor 0805 (2012 Metric) Thin Film; Power (Watts): 0.1W, 1/10W; mfg P/N: RR1220P-8251-D-M; Category: Resistors  Chip Resistor - Surface Mount; Mfr: Susumu; Series: RR; Part Status: Active; Composition: Thin Film; Operating Temperature: -55°C ~ 125°C; Package / Case: 0805 (2012 Metric); Size / Dimension: 0.079"" L x 0.049"" W (2.00mm x 1.25mm); Height - Seated (Max): 0.020"" (0.50mm); Number of Terminations: 2; Supplier 1: Mouser; Supplier Part Number 1: 754-RR1220P-8251D-M; Supplier 2: Digikey; Supplier Part Number 2: RR12P8.25KDCT-ND; Supplier 3: Digikey; Supplier Part Number 3: RR12P8.25KDDKR-ND; Supplier 4: Future Electronics; Supplier Part Number 4: 3847365; Supplier 5: Digikey; Supplier Part Number 5: RR12P8.25KDTR-ND
R3 R20 R21 R32 = Res,0805,10.0kΩ,0.1%,±25ppm/°C,RG2012P-103-B-T5: RES SMD 10K OHM 0.1% 1/8W 0805; Mfr: Susumu; Lead-Free Status: Contains Lead; Voltage Rating (DC): 150.0 V; Detailed Description: 10 kOhms ±0.1% 0.125W, 1/8W Chip Resistor 0805 (2012 Metric) Anti-Sulfur, Automotive AEC-Q200 Thin Film; Power (Watts): 0.125W, 1/8W; Number of Pins: 2; Mounting Style: Surface Mount; mfg P/N: RG2012P-103-B-T5; Category: Resistors  Chip Resistor - Surface Mount; Series: RG; Part Status: Active; Features: Anti-Sulfur, Automotive AEC-Q200; Operating Temperature: -55°C ~ 155°C; Package / Case: 0805 (2012 Metric); Supplier Device Package: 0805; Ratings: AEC-Q200; Size / Dimension: 0.079" L x 0.049" W (2.00mm x 1.25mm); Height - Seated (Max): 0.020" (0.50mm); Number of Terminations: 2; Supplier 1: Future Electronics; Supplier Part Number 1: 4000243; Supplier 2: Mouser; Supplier Part Number 2: 754-RG2012P-103-B-T5; Supplier 3: Digikey; Supplier Part Number 3: RG20P10.0KBCT-ND; Supplier 4: Digikey; Supplier Part Number 4: RG20P10.0KBDKR-ND; Supplier 5: Digikey; Supplier Part Number 5: RG20P10.0KBTR-ND
R4 R8 = Res,0805,100Ω,5%,±200ppm/°C: RES 100 OHM 5% 1/8W 0805; Lead-Free Status: Lead Free; Power Rating: 0.125 W; Detailed Description: 100 Ohms ±5% 0.125W, 1/8W Chip Resistor 0805 (2012 Metric) Thick Film; Case/Package: 0805 (2012 Metric); Number of Pins: 2; RoHS: Compliant; mfg P/N: CRCW0805100RJNEAC; Tolerance: ±5%; Temperature Coefficient: ±200ppm/°C; Operating Temperature: -55°C ~ 155°C; Supplier 1: Digi-Key; Supplier Part Number 1: 541-100ACT-ND; Supplier 2: Mouser; Supplier Part Number 2: 71-CRCW0805100RJNEAC; Supplier 3: Arrow Electronics; Supplier Part Number 3: CRCW0805100RJNEAC; Supplier 4: Digikey; Supplier Part Number 4: 541-4166-1-ND; Supplier 5: Digikey; Supplier Part Number 5: 541-4166-6-ND; Supplier 6: Mouser; Supplier Part Number 6: 71-CRCW0805100RJNEA; Supplier 7: Digikey; Supplier Part Number 7: 541-100ACT-ND; Supplier 8: Digikey; Supplier Part Number 8: 541-100ADKR-ND; Supplier 9: Future Electronics; Supplier Part Number 9: 7083546
R5 = Res,2512,10mΩ,3.00W,±1%,CRA2512-FZ-R010ELF: Resistor; Metal Film; Res 0.01 Ohms; Pwr-Rtg 3 W; Tol 1%; SMT; 2512; Current Sense; Case/Package (SI): 2512; Resistance Tolerance: ±1%; Octopart URL: http://octopart.com/cra2512-fz-r010elf-bourns-7483589; Manufacturer Part Number: CRA2512-FZ-R010ELF; Packaging: Tape & Reel (TR), Cut Tape (CT); REACH SVHC Compliance: No SVHC; RoHS: Compliant; Number of Pins: 2; Mounting Style: Surface Mount; Case/Package: 1005; Supplier 1: Arrow Electronics; Supplier Part Number 1: CRA2512-FZ-R010ELF; Supplier 2: Digikey; Supplier Part Number 2: CRA2512-FZ-R010ELFCT-ND; Supplier 3: Mouser; Supplier Part Number 3: 652-CRA2512FZR010ELF
R6 R24 = Res,0805,976KΩ,±0.1%,±25ppm/°C,ERA-6AEB9763V: RES SMD 976K OHM 0.1% 1/8W 0805; Manufacturer: Panasonic Electronic Components; Detailed Description: 976 kOhms ±0.1% 0.125W, 1/8W Chip Resistor 0805 (2012 Metric) Automotive AEC-Q200 Thin Film; Power (Watts): 0.125W, 1/8W; Features  Automotive: AEC-Q200; mfg P/N: ERA-6AEB9763V; Category: Resistors  Chip Resistor - Surface Mount; Mfr: Panasonic Electronic Components; Series: ERA-6A; Part Status: Active; Composition: Thin Film; Operating Temperature: -55°C ~ 155°C; Package / Case: 0805 (2012 Metric); Supplier Device Package: 0805; Ratings: AEC-Q200; Size / Dimension: 0.079" L x 0.049" W (2.00mm x 1.25mm); Height - Seated (Max): 0.024" (0.60mm); Number of Terminations: 2; Base Product Number: ERA-6AEB; Supplier 1: Mouser; Supplier Part Number 1: 667-ERA-6AEB9763V; Supplier 2: Future Electronics; Supplier Part Number 2: 9105847; Supplier 3: Digikey; Supplier Part Number 3: P976KDACT-ND; Supplier 4: Digikey; Supplier Part Number 4: P976KDADKR-ND; Supplier 5: Future Electronics; Supplier Part Number 5: 5032934; Supplier 6: Digikey; Supplier Part Number 6: P976KDATR-ND
R7 R10 R11 R14 R16 R18 = Res,0805,470Ω,±0.1%,±25ppm/°C,ERA-6AEB471V: RES SMD 470 OHM 0.1% 1/8W 0805; Manufacturer: Panasonic Electronic Components; Detailed Description: 470 Ohms ±0.1% 0.125W, 1/8W Chip Resistor 0805 (2012 Metric) Automotive AEC-Q200 Thin Film; Power (Watts): 0.125W, 1/8W; Features  Automotive: AEC-Q200; mfg P/N: ERA-6AEB471V; Category: Resistors  Chip Resistor - Surface Mount; Mfr: Panasonic Electronic Components; Series: ERA-6A; Part Status: Active; Composition: Thin Film; Operating Temperature: -55°C ~ 155°C; Package / Case: 0805 (2012 Metric); Supplier Device Package: 0805; Ratings: AEC-Q200; Size / Dimension: 0.079" L x 0.049" W (2.00mm x 1.25mm); Height - Seated (Max): 0.024" (0.60mm); Number of Terminations: 2; Base Product Number: ERA-6AEB
R13 R15 R19 R23 R27 = Res,0805,10.0kΩ,1%,100 ppm,CRCW080510K0FKTA: RES SMD 10K OHM 1% 1/8W 0805; Temperature Coefficient: 100.0 ppm/C; Lead-Free Status: Contains Lead; Voltage Rating (DC): 150.0 V; Power Rating: 0.125 W; Case/Package (SI): 2012; Size-Width: 0.00125 m; Resistance Tolerance: 1%; Size-Length: 0.002 m; RoHS: Non-Compliant; Power Dissipation: 0.125 W; Number of Pins: 2; REACH SVHC Compliance: No SVHC; Size-Height: 0.00045 m; Case/Package: 0805; Mounting Style: Surface Mount; Supplier 1: Digi-Key; Supplier Part Number 1: 541-3016-1-ND
R17 R22 R25 R26 R29 = Res,0805,100K,±0.1%,±25ppm/°C,ERA-6AEB104V: RES SMD 100K OHM 0.1% 1/8W 0805; Manufacturer: Panasonic Electronic Components; Detailed Description: 100 kOhms ±0.1% 0.125W, 1/8W Chip Resistor 0805 (2012 Metric) Automotive AEC-Q200 Thin Film; Power (Watts): 0.125W, 1/8W; Features  Automotive: AEC-Q200; mfg P/N: ERA-6AEB104V; Category: Resistors  Chip Resistor - Surface Mount; Mfr: Panasonic Electronic Components; Series: ERA-6A; Part Status: Active; Composition: Thin Film; Operating Temperature: -55°C ~ 155°C; Package / Case: 0805 (2012 Metric); Supplier Device Package: 0805; Ratings: AEC-Q200; Size / Dimension: 0.079" L x 0.049" W (2.00mm x 1.25mm); Height - Seated (Max): 0.024" (0.60mm); Number of Terminations: 2; Base Product Number: ERA-6AEB; Supplier 1: Mouser; Supplier Part Number 1: 667-ERA-6AEB104V; Supplier 2: Future Electronics; Supplier Part Number 2: 3098727; Supplier 3: Digikey; Supplier Part Number 3: P100KDACT-ND
R28 = Res,POT,SMD,100Ω,0.1W, TC33X-2-101E: TRIMMER 100 OHM 0.1W J LEAD TOP; Manufacturer: Bourns Inc.; Detailed Description: 100 Ohms 0.1W, 1/10W J Lead Surface Mount Trimmer Potentiometer Cermet 1 Turn Top Adjustment; Power (Watts): 0.1W, 1/10W; Tolerance: ±25%; Temperature Coefficient: ±250ppm/°C; Adjustment Type: Top Adjustment; Resistive Material: Cermet; Number of Turns: 1; mfg P/N: TC33X-2-101E; Datasheets: TC33 Series; Category: Potentiometers, Variable Resistors  Trimmer Potentiometers; Series: Trimpot® TC33 - Open Frame; Part Status: Active; Mounting Type: Surface Mount; Termination Style: J Lead; Size / Dimension: Rectangular - 0.150"" x 0.142"" Face x 0.047"" H (3.80mm x 3.60mm x 1.20mm); Supplier 1: Digi-Key; Supplier 2: Digi-Key; Supplier Part Number 2: TC33X-101EDKR-ND
R30 R31 = Res,0805,820KΩ,±0.1%,±25ppm/°C,RG2012P-824-D-T5: RES SMD 820K OHM 0.5% 1/8W 0805; Manufacturer: Susumu; Detailed Description: 820 kOhms ±0.5% 0.125W, 1/8W Chip Resistor 0805 (2012 Metric) Anti-Sulfur, Automotive AEC-Q200 Thin Film; Power (Watts): 0.125W, 1/8W; Features  Automotive: AEC-Q200; Base Product Number: ERA-6AEB; mfg P/N: RG2012P-824-D-T5; Category: Resistors  Chip Resistor - Surface Mount; Mfr: Susumu; Series: RG; Part Status: Active; Composition: Thin Film; Operating Temperature: -55°C ~ 155°C; Package / Case: 0805 (2012 Metric); Supplier Device Package: 0805; Ratings: AEC-Q200; Size / Dimension: 0.079" L x 0.049" W (2.00mm x 1.25mm); Height - Seated (Max): 0.024" (0.60mm); Number of Terminations: 2; Supplier 1: Digikey; Supplier Part Number 1: 408-RG2012P-824-D-T5CT-ND; Supplier 2: Digikey; Supplier Part Number 2: 408-RG2012P-824-D-T5TR-ND; Supplier 3: Digikey; Supplier Part Number 3: 408-RG2012P-824-D-T5DKR-ND; Supplier 4: Mouser; Supplier Part Number 4: 754-RG2012P-824DT5
R33 = Res,0805,1.5KΩ,0.1%,±25ppm/°C,RG2012P-152-B-T5: RES SMD 1.5K OHM 0.1% 1/8W 0805; Manufacturer: Susumu; Detailed Description: 1.5 kOhms ±0.1% 0.125W, 1/8W Chip Resistor 0805 (2012 Metric) Anti-Sulfur, Automotive AEC-Q200 Thin Film; Power (Watts): 0.125W, 1/8W; mfg P/N: RG2012P-152-B-T5; Category: Resistors  Chip Resistor - Surface Mount; Series: RG; Part Status: Active; Composition: Thin Film; Features: Anti-Sulfur, Automotive AEC-Q200; Temperature Coefficient: ±25ppm/°C; Operating Temperature: -55°C ~ 155°C; Package / Case: 0805 (2012 Metric); Supplier Device Package: 0805; Ratings: AEC-Q200; Size / Dimension: 0.079" L x 0.049" W (2.00mm x 1.25mm); Height - Seated (Max): 0.020" (0.50mm); Number of Terminations: 2
U2 = IC,CurrentSense,Isolated,8.2 Gain,500Khz,SI8921BD-IS4R: Isolation IC Inverters, Power Supplies, UPS 8-SOIC; Mfr: Skyworks Solutions Inc.; Base Product Number: SI8921; Detailed Description: Isolation IC Inverters, Power Supplies, UPS 8-SOIC; Category: Integrated Circuits (ICs)  Linear  Amplifiers  Special Purpose Amplifiers; Part Status: Active; Type: Isolation; Applications: Automotive, Inverters, Power Supplies, UPS; Mounting Type: Surface Mount; Package / Case: 8-SOIC (0.295", 7.50mm Width); Supplier Device Package: 8-SOIC; Supplier 1: Digikey; Supplier Part Number 1: 863-SI8921BD-IS4RCT-ND; Supplier 2: Digikey; Supplier Part Number 2: 863-SI8921BD-IS4RDKR-ND; Supplier 3: Digikey; Supplier Part Number 3: 863-SI8921BD-IS4RTR-ND; Supplier 4: Mouser; Supplier Part Number 4: 634-SI8921BDIS4
U3 U8 = OPAMP, single, General Purpose,Rail-to-Rail,10MHz,SOT-23-5,OPA197IDBVT: General Purpose Amplifier 1 Circuit Rail-to-Rail SOT-23-5; Manufacturer: Texas Instruments; Supply Current: 1mA; Number of Channels: 1; Slew Rate: 20V/μs; Gain Bandwidth Product: 10MHz; Voltage - Input Offset: 25uV; Current - Output / Channel: 65mA; Current - Input Bias: 5pA; Voltage - Supply, Single/Dual (±): 4.5 V ~ 36 V, ±2.25 V ~ 18 V; REACH SVHC Compliance: No SVHC; Operating Temperature: -40°C ~ 125°C; Supplier Device Package: SOT-23-5; Supplier 1: LCSC; Supplier Part Number 1: C131929; Supplier 2: Digi-Key; Supplier Part Number 2: 296-44076-6-ND; Mfg P/N: OPA197IDBVT
U5 U9 = OPAMP,20Mhz,MOSFET DRIVER,SOT23-5,LM7321MF: Single Rail-to-Rail Input/Output, ±15V, High Output Current and Unlimited Capacitive Load Operational Amplifier, 5-pin SOT-23, Pb-Free; Bandwidth: 20000000.0 Hz; Input Offset Drift: 2e-06 V/K; Lead-Free Status: Lead Free; Number of Channels: 1; Output Current: 0.06 A; Slew Rate: 18.0 V/μs; Case/Package: SOIC; Gain Bandwidth Product: 20000000.0 Hz; Lifecycle Status: Active; Mounting Style: Surface Mount; Number of Pins: 5; Packaging: Tape & Reel (TR); REACH SVHC Compliance: No SVHC; RoHS: Compliant; mfg P/N: LM7321MF/NOPB; Supplier 1: Digi-Key; Supplier Part Number 1: LM7321MF/NOPBCT-ND; Supplier 2: LCSC; Supplier Part Number 2: C128614; Supplier 3: Digikey; Supplier Part Number 3: 296-LM7321MFE/NOPBTR-ND; Supplier 4: Digikey; Supplier Part Number 4: 296-LM7321QMFX/NOPBTR-ND

## Nets that join several sheets
+5: MelansonTech PSU_IsolatedShuntAmp Rev2 (5 pins), MelansonTech Isolated Shunt Amplifier rev 2 (C2.2 U2.8)
+5_ISO: MelansonTech PSU_IsolatedShuntAmp Rev2 (C13.2 C14.2 C20.2 Mod1.4), MelansonTech Isolated Shunt Amplifier rev 2 (C1.2 U2.1)
+12: MelansonTech PSU_IsolatedShuntAmp Rev2 (C32.2 C33.2 U1.1), MelansonTech Isolated Shunt Amplifier rev 2 (12 pins)
GND: MelansonTech PSU_IsolatedShuntAmp Rev2 (26 pins), MelansonTech Isolated Shunt Amplifier rev 2 (22 pins)
GND_ISO: MelansonTech PSU_IsolatedShuntAmp Rev2 (5 pins), MelansonTech Isolated Shunt Amplifier rev 2 (C1.1 NT1.2 U2.4)
ISenseRTN: MelansonTech PSU_IsolatedShuntAmp Rev2 (C29.1 C30.2), MelansonTech Isolated Shunt Amplifier rev 2 (12 pins)
HighGain: MelansonTech PSU_IsolatedShuntAmp Rev2 (D1.2 SW1.4), MelansonTech Isolated Shunt Amplifier rev 2 (6 pins)